# Altium schematic sheet RGB_Plugin_Board.SchDoc: Bluebell MFG PCB
size B; Author: AM; CompanyName: Cambridge Mobile Telematics; DrawnBy: A.Marles; Engineer: DM; Organization: Silver Bullet Technology; Address1: Schematic; Address2: 101 Main Street, 14th Floor; Address3: Cambridge, MA 02142; Address4: USA; DocumentNumber: 1; SheetNumber: 1; SheetTotal: 2
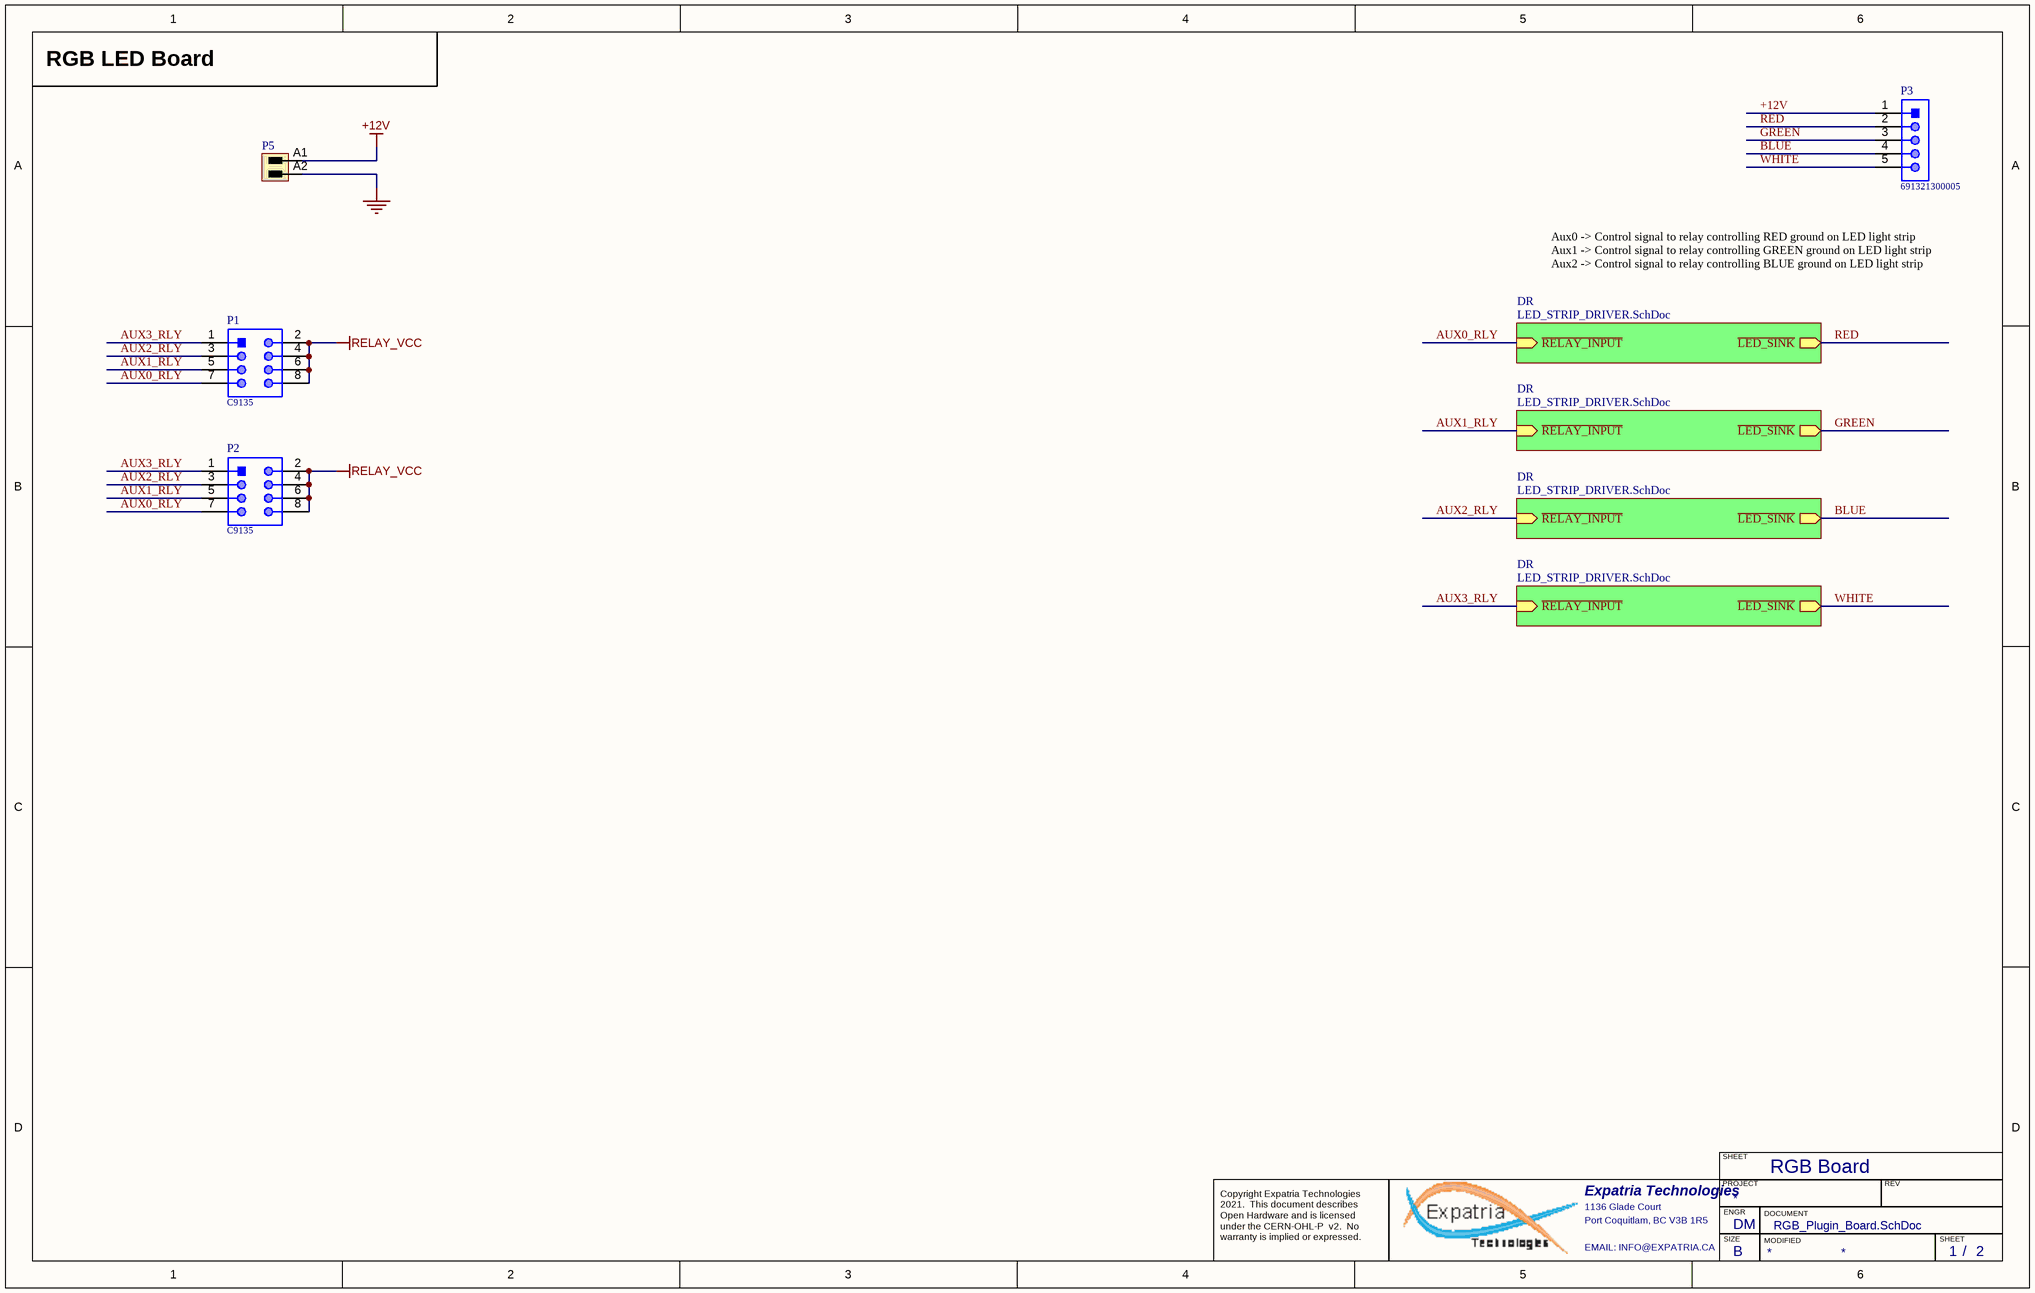
[diagram p0: RGB_Plugin_Board.SchDoc]

## Parts
P1  C9135  [61200821621]
P2  C9135  [61200821621]
P3  691321300005  [691321300005]
P5  (no value)  [SL_3_50_180G_02]

## Sub-sheets
DR = LED_STRIP_DRIVER.SchDoc: ~{LED_SINK} (out), ~{RELAY_INPUT} (in)
DR = LED_STRIP_DRIVER.SchDoc: ~{LED_SINK} (out), ~{RELAY_INPUT} (in)
DR = LED_STRIP_DRIVER.SchDoc: ~{LED_SINK} (out), ~{RELAY_INPUT} (in)
DR = LED_STRIP_DRIVER.SchDoc: ~{LED_SINK} (out), ~{RELAY_INPUT} (in)

## Nets
+12V: P3.1 P5.A1
GND: P5.A2
RELAY_VCC: P1.2 P1.4 P1.6 P1.8 P2.2 P2.4 P2.6 P2.8
AUX0_RLY: P1.7 P2.7 ; sheet DR/~{RELAY_INPUT}
AUX1_RLY: P1.5 P2.5 ; sheet DR/~{RELAY_INPUT}
AUX2_RLY: P1.3 P2.3 ; sheet DR/~{RELAY_INPUT}
AUX3_RLY: P1.1 P2.1 ; sheet DR/~{RELAY_INPUT}
BLUE: P3.4 ; sheet DR/~{LED_SINK}
GREEN: P3.3 ; sheet DR/~{LED_SINK}
RED: P3.2 ; sheet DR/~{LED_SINK}
WHITE: P3.5 ; sheet DR/~{LED_SINK}

## Notes on the sheet
- RGB LED Board
- Aux0 -> Control signal to relay controlling RED ground on LED light strip
  Aux1 -> Control signal to relay controlling GREEN ground on LED light strip
  Aux2 -> Control signal to relay controlling BLUE ground on LED light strip
- RGB Board
- SHEET
- Expatria Technologies
- 1136 Glade Court
- Port Coquitlam, BC V3B 1R5
- PROJECT
- SIZE
- ENGR
- MODIFIED
- DOCUMENT
- REV
- Copyright Expatria Technologies 2021.  This document describes Open Hardware and is licensed under the CERN-OHL-P  v2.  No warranty is implied or expressed.
- EMAIL: INFO@EXPATRIA.CA
- B
- /

## Library data of the parts
P1 P2 = CMP-1502-00006-1: Male Box Header WR-BHD, THT, Vertical, pitch 2.54 mm, 8 pins; Manufacturer: Wurth Elektronik; Pitch: 2.54mm; Publisher: WurthElektronik; Part Number: C9135; Packaging: Tray; Published Date: August2018; Package Reference: 61200821621; SuppliersPartNumber: C9135
P3 = CMP-1502-01866-1: Serie 321 - 3.81mm Vertical PCB Header WR-TBL, 5 pin; Manufacturer: Wurth Elektronik; Gender: Male; Pin Number: 5; Packaging: Box; Package Reference: 691321300005; Mounting Technology: THT; Operating Temperature: -40to105degC; Pitch: 3.81mm; Manufacturer URL: http://www.we-online.de; Datasheet URL: http://katalog.we-online.de/em/datasheet/6913213000xx.pdf; Publisher: WurthElektronik; Part Number: 691321300005; SuppliersPartNumber: C880557
P5 = CMP-1559-00901-1: Header,Male Pin,Covered(4 Sided) 2 1 0.138"（3.50mm） 2 P=3.5mm Pluggable System Terminal Block RoHS; PartNumber: WJ15EDGVC-3.5-2P; Manufacturer: Ningbo Kangnex Elec; UL_94_flammability_rating: V-0; Pitch_mm: 3.5 mm; Side_termination_characteristic: closed side; Pitch_inch: 0.138 inch; Solder_pin_length_mm: 3.2 mm; Short_text_for_material: SL 3.50/02/180G 3.2SN OR BX; Revision: V1; PackageReference: SL_3_50_180G_02; Packaging: Box; SuppliersPartNumber: C192777